# Altium project RGB_Controller_AC.PrjPcb
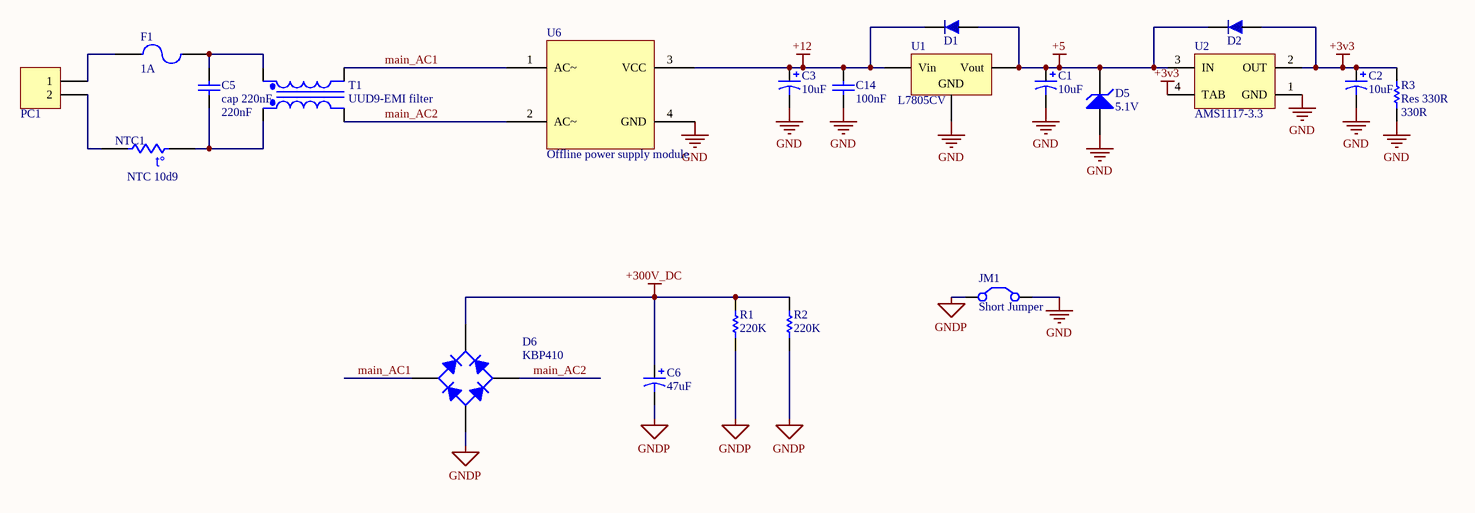
[diagram p0: power.SchDoc]
3 sheets, 70 parts. Net scope: flat (ports and power ports of the same name join across sheets).
Board files: RGB_driver_AC_2.PcbDoc, RGB_driver_AC.PcbDoc
Sheets:
  power.SchDoc
  micro.SchDoc
  driver.SchDoc

## Sheet power.SchDoc
size A4; SheetNumber: 1; SheetTotal: 3; SPICEModelCacheXGUZSKWJ: <root> / <DocumentId>XGUZSKWJ</DocumentId> / <CacheFrame Number="0"> / <Model Name="cap" Kind="MDL"> / <Text>*Default semiconductor capacitor / .MODEL CAP C()</Text> / </Model> / <Model Name="zener" Kind="MDL"> / <Text>*ZENER / *Default Zener 10V @ 10mA / *Zener Diode Pinout: A,K / .MODEL ZENER D( BV=10 IBV=10E-3 )</Text> / </Model> / <Model Name="fuse" Kind="CKT"> / <Text>.SUBCKT FUSE 1 2 PARAMS: CURRENT=1 RESISTANCE=1m / SW1 1 2 3 0 SMOD OFF / BNLV 3 0 V=(abs(v(1,2))) / .MODEL SMOD SW (VT={(CURRENT*RESISTANCE)} RON=1g ROFF={RESISTANCE}) / .ENDS FUSE</Text> / </Model> / </CacheFrame> / </root>

### Parts
C1  value 10uF  [CAP0805]  (hidden comment: cap 10uF)
C2  value 10uF  [CAP0805]  (hidden comment: cap 10uF)
C3  value 10uF  [CAP0805]  (hidden comment: cap 10uF)
C5  cap 220nF  value 220nF  [MKT-15mm]
C6  value 47uF  [Cap16MM]  (hidden comment: cap 47uF)
C14  value 100nF  [CAP0805]  (hidden comment: cap 100nF)
D1  uf4007  [DIOM4629X24N]  (value not drawn)
D2  uf4007  [DIOM4629X24N]  (value not drawn)
D5  5.1V  [Diode 1n4148 SMD]
D6  KBP410  [Bridge KBL PACKAGE]
F1  1A  [PIN-W2/E2.8]
JM1  Short Jumper  [short_bridge]  (net tie, no BOM)
NTC1  NTC 10d9  [CAPNTO5.08-7.37x3.94]
PC1  Power Connector  [phoenix terminal R 2]  (value not drawn)
R1  value 220K  [RES-(1/2)-Stand]  (hidden comment: Res 220K)
R2  value 220K  [RES-(1/2)-Stand]  (hidden comment: Res 220K)
R3  Res 330R  value 330R  [RES0805]
T1  UUD9-EMI filter  [UUD9.8]
U1  L7805CV  [REG-7805-smd]
U2  AMS1117-3.3  [SOT223]
U6  Offline power supply module  [220AC-12VDC  450mA]

### Nets
+3v3: C2.1 D2.1 R3.2 U2.2(OUT) U2.4(TAB)
+5: C1.1 D1.1 D2.2 D5.2(K) U1.3(Vout) U2.3(IN)
+12: C3.1 C14.1 D1.2 U1.1(Vin) U6.3(VCC)
+300V_DC: C6.1 D6.1(K) R1.2 R2.2
GND: C1.2 C2.2 C3.2 C14.2 D5.1(A) JM1.2 R3.1 U1.2(GND) U2.1(GND) U6.4(GND)
GNDP: C6.2 D6.3(A) JM1.1 R1.1 R2.1
main_AC1: D6.4(C) T1.4(Sec-) U6.1(AC~)
main_AC2: D6.2(C) T1.2(Pri-) U6.2(AC~)
NetC5_1: C5.1 NTC1.1 T1.1(Pri+)
NetC5_2: C5.2 F1.2 T1.3(Sec+)
NetF1_1: F1.1 PC1.1
NetNTC1_2: NTC1.2 PC1.2

### Notes on the sheet
- (in symbol Res Thermal) t°

### Library data of the parts
C1-C3 = Cap Pol1: CAP seramic; Published: 8-Jun-2000; LatestRevisionDate: 17-Jul-2002; LatestRevisionNote: Re-released for DXP Platform.; PackageReference: RB7.6-15; Publisher: Altium Limited; PackageDescription: Polarized Capacitor (Radial); 2 Leads
C5 = Cap: Cap MKT 275V; Published: 8-Jun-2000; LatestRevisionDate: 17-Jul-2002; LatestRevisionNote: Re-released for DXP Platform.; PackageReference: RAD-0.3; Publisher: Altium Limited; PackageDescription: Radial Cap, Thru-Hole; 2 Leads; 0.3 in Pin Spacing
C6 = Cap Pol1: Polarized Capacitor (Radial) 400V; Published: 8-Jun-2000; LatestRevisionDate: 17-Jul-2002; LatestRevisionNote: Re-released for DXP Platform.; PackageReference: RB7.6-15; Publisher: Altium Limited; PackageDescription: Polarized Capacitor (Radial); 2 Leads
C14 = Cap ceramic: CAP seramic
D1 D2 = 1n4007 SMD M7: Standard Rectifiers; Part. No: M7; Manufacturer: DC COMPONENTS; Designer: Abbas Basereh; Link: http://www.tme.eu/en/details/m7/smd-universal-diodes/dc-components/; Link: https://www.aliexpress.com/item/Smd-tube-1n4007-m7-SMA/1213719741.html?spm=2114.01010208.3.1.ZyZ7bC&ws_ab_test=searchweb0_0,searchweb201602_4_10065_10068_10084_10083_10080_10082_10081_10060_10061_10062_10056_10055_10054_10059_10099_10078_10079_427_10073_10103_10102_10096_10052_10050_10051,searchweb201603_4&btsid=db2be5ca-e560-400a-b91c-484ab5ee228b; Data: 16-12-2016
D5 = D Zener: Zener Diode; Published: 8-Jun-2000; LatestRevisionDate: 17-Jul-2002; LatestRevisionNote: Re-released for DXP Platform.; PackageReference: DIODE-0.7; Publisher: Altium Limited; PackageDescription: Diode, Thru-Hole; 2 Leads; 0.7 in Pin Spacing
D6 = Diode Bridge: pin to pad: 3>4 4>3; Company: E.P.I.L; Design Date: 2011/11/02
F1 = Fuse 2: Fuse; Published: 8-Jun-2000; LatestRevisionDate: 17-Jul-2002; LatestRevisionNote: Re-released for DXP Platform.; PackageReference: PIN-W2/E2.8; Publisher: Altium Limited; PackageDescription: Thru-Hole; 2 Leads
JM1 = Solder Jumper: short circuit
NTC1 = Res Thermal: NTC; Published: 24-Mar-1999; LatestRevisionDate: 29-May-2009; LatestRevisionNote: IPC-7351 Footprint Added.; PackageVersion: Mar-2003; PackageReference: 6-0805; Publisher: Altium Limited; PackageDescription: Chip Resistor 0805 Case Size; Code_IPC: RESC2012
PC1 = Power Connector: white Power Connector
R1-R3 = Res1: Resistor; Published: 8-Jun-2000; LatestRevisionDate: 17-Jul-2002; LatestRevisionNote: Re-released for DXP Platform.; PackageReference: AXIAL-0.3; Publisher: Altium Limited; PackageDescription: Axial Device, Thru-Hole; 2 Leads; 0.3 in Pin Spacing
T1 = Trans Cupl: Line filter; Published: 8-Jun-2000; LatestRevisionDate: 17-Jul-2002; LatestRevisionNote: Re-released for DXP Platform.; PackageReference: TRF_4; Publisher: Altium Limited; PackageDescription: Transformer; 4 Leads
U1 = L7805CV-Linear Voltage Regulator IC Positive 1 Output 5V 1.5A TO-220AB: Linear Voltage Regulator IC Positive FIXED; Manufacturer: STMicroelectronics; Designer: Abbas Basereh; Link: https://www.aliexpress.com/item/; Link: http://www.tme.eu/en/; Link: http://www.digikey.com/; Part. No: L7805CV
U2 = AMS1117-x.x: x.x Volt, 800mA Low-Dropout Linear Regulator, 4-pin SOT-223; Designer: Ali Hafizi; Data: 16-12-2016
U6 = Power Supply Module

## Sheet micro.SchDoc
size A4; SheetNumber: 2; SheetTotal: 3; SPICEModelCacheMVBHQZXF: <root> / <DocumentId>MVBHQZXF</DocumentId> / <CacheFrame Number="0"> / <Model Name="2n3904" Kind="MDL"> / <Text>*2N3904 / *Si 310mW  40V 200mA 300MHz pkg:TO-92B 1,2,3 / .MODEL 2N3904 NPN(IS=1.4E-14 BF=300 VAF=100 IKF=0.025 ISE=3E-13 / + BR=7.5 RC=2.4 CJE=4.5E-12 TF=4E-10 CJC=3.5E-12 TR=2.1E-8 XTB=1.5 KF=9E-16 )</Text> / </Model> / <Model Name="led0" Kind="MDL"> / <Text>*Typ INFRARED GaAs LED: Vf=1.2V Vr=5V If=40mA trr=3uS / *LED Pinout: 1=A, 2=K / .MODEL LED0 D (IS=93.5P RS=84M N=2.63 BV=5 IBV=10U / + CJO=2.97P VJ=.75 M=.333 TT=4.32U)</Text> / </Model> / </CacheFrame> / </root>
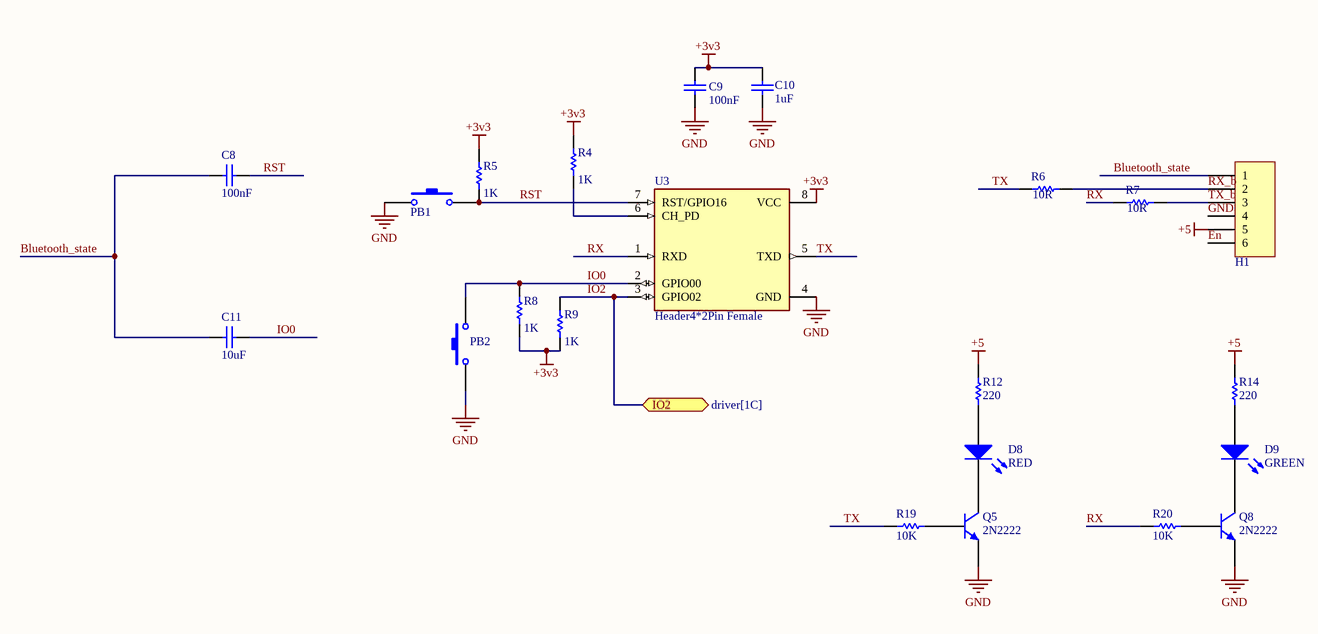
[diagram p1: micro.SchDoc]

### Parts
C8  value 100nF  [CAP0805]  (hidden comment: cap 100nF)
C9  value 100nF  [CAP0805]  (hidden comment: cap 100nF)
C10  value 1uF  [CAP0805]  (hidden comment: cap 1uF)
C11  value 10uF  [CAP0805]  (hidden comment: cap 10uF)
D8  RED  [LED_0603 R]
D9  GREEN  [LED_0603 G]
H1  H-1x6  [H-1x6]  (value not drawn)
PB1  Push-Button-tall  [tack-sw-3x5x6]  (value not drawn)
PB2  Push-Button-tall  [tack-sw-3x5x6]  (value not drawn)
Q5  2N2222  [SOT23_BEC_L]
Q8  2N2222  [SOT23_BEC_L]
R4  value 1K  [RES0805]  (hidden comment: Res 1K)
R5  value 1K  [RES0805]  (hidden comment: Res 1K)
R6  value 10R  [RES0805]  (hidden comment: Res 10R)
R7  value 10R  [RES0805]  (hidden comment: Res 10R)
R8  value 1K  [RES0805]  (hidden comment: Res 1K)
R9  value 1K  [RES0805]  (hidden comment: Res 1K)
R12  value 220  [RES0805]  (hidden comment: Res 220)
R14  value 220  [RES0805]  (hidden comment: Res 220)
R19  value 10K  [RES0805]  (hidden comment: Res 10K)
R20  value 10K  [RES0805]  (hidden comment: Res 10K)
U3  Header4*2Pin Female  [ESP8266-01/ESP-01]

### Ports
IO2 (bidir, see driver[1C])

### Nets
+3v3: C9.2 C10.1 R4.1 R5.1 R8.2 R9.2 U3.8(VCC)
+5: H1.5 R12.2 R14.2
GND: C9.1 C10.2 H1.4 PB1.1 PB2.1 Q5.1(E) Q8.1(E) U3.4(GND)
Bluetooth_state: C8.2 C11.2 H1.1
En: H1.6
IO0: C11.1 PB2.2 R8.1 U3.2(GPIO00)
IO2: R9.1 U3.3(GPIO02) ; port IO2
RST: C8.1 PB1.2 R5.2 U3.7(RST/GPIO16)
RX: R7.2 R20.1 U3.1(RXD)
RX_b: H1.2 R6.2
TX: R6.1 R19.1 U3.5(TXD)
TX_b: H1.3 R7.1
NetD8_1: D8.1(A) R12.1
NetD8_2: D8.2(K) Q5.3(C)
NetD9_1: D9.1(A) R14.1
NetD9_2: D9.2(K) Q8.3(C)
NetQ5_2: Q5.2(B) R19.2
NetQ8_2: Q8.2(B) R20.2
NetR4_2: R4.2 U3.6(CH_PD)

### Library data of the parts
C8-C11 = Cap ceramic: CAP seramic
D8 D9 = LED0: Typical INFRARED GaAs LED; Published: 8-Jun-2000; LatestRevisionDate: 08-Jul-2005; LatestRevisionNote: Mech Layer 1 removed.; PackageReference: LED-0; Publisher: Altium Limited; PackageDescription: LED; 2 Leads
H1 = H-1x6: Bluetooth module HC05
Q5 Q8 = 2N3904: NPN General Purpose Amplifier; pin to pad: 1>2 2>1; Published: 8-Jun-2000; LatestRevisionDate: 15-Jan-2003; LatestRevisionNote: PCB Footprint 'BCY-W3/D4.7' replaced; DatasheetVersion: 1997; PackageVersion: Sep-1998; PackageReference: TO-92A; Publisher: Altium Limited; PackageDescription: TO, Flat Index; 3 In-Line, Axial Leads; Body Dia. 4.5mm; Leads 0.51 x 0.48 mm (max); ComponentLink1Description: Manufacturer Link; ComponentLink1URL: http://www.fairchildsemi.com/; ComponentLink2Description: Datasheet; ComponentLink2URL: http://www.fairchildsemi.com/ds/2N%2F2N3904.pdf
R4-R9 R12 R14 R19 R20 = Res1: Resistor; Published: 8-Jun-2000; LatestRevisionDate: 17-Jul-2002; LatestRevisionNote: Re-released for DXP Platform.; PackageReference: AXIAL-0.3; Publisher: Altium Limited; PackageDescription: Axial Device, Thru-Hole; 2 Leads; 0.3 in Pin Spacing
U3 = ESP8266-01/ESP-01: ESP-01 wifi module; MF: AI-Thinker; Package: None; Availability: Unavailable; MP: ESP8266-01/ESP-01; Value: *; SnapEDA_Link: https://www.snapeda.com/parts/ESP8266-01/ESP-01/AI-Thinker/view-part/106413/?ref=snap; Price: None

## Sheet driver.SchDoc
size A4; SheetNumber: 3; SheetTotal: 3; SPICEModelCacheZVOPVZIA: <root> / <DocumentId>ZVOPVZIA</DocumentId> / <CacheFrame Number="0"> / <Model Name="nmos" Kind="MDL"> / <Text>*Default N-Channel MOSFET / *Pinout: D,G,S / .MODEL NMOS NMOS()</Text> / </Model> / <Model Name="2n3904" Kind="MDL"> / <Text>*2N3904 / *Si 310mW  40V 200mA 300MHz pkg:TO-92B 1,2,3 / .MODEL 2N3904 NPN(IS=1.4E-14 BF=300 VAF=100 IKF=0.025 ISE=3E-13 / + BR=7.5 RC=2.4 CJE=4.5E-12 TF=4E-10 CJC=3.5E-12 TR=2.1E-8 XTB=1.5 KF=9E-16 )</Text> / </Model> / <Model Name="cap" Kind="MDL"> / <Text>*Default semiconductor capacitor / .MODEL CAP C()</Text> / </Model> / </CacheFrame> / </root>
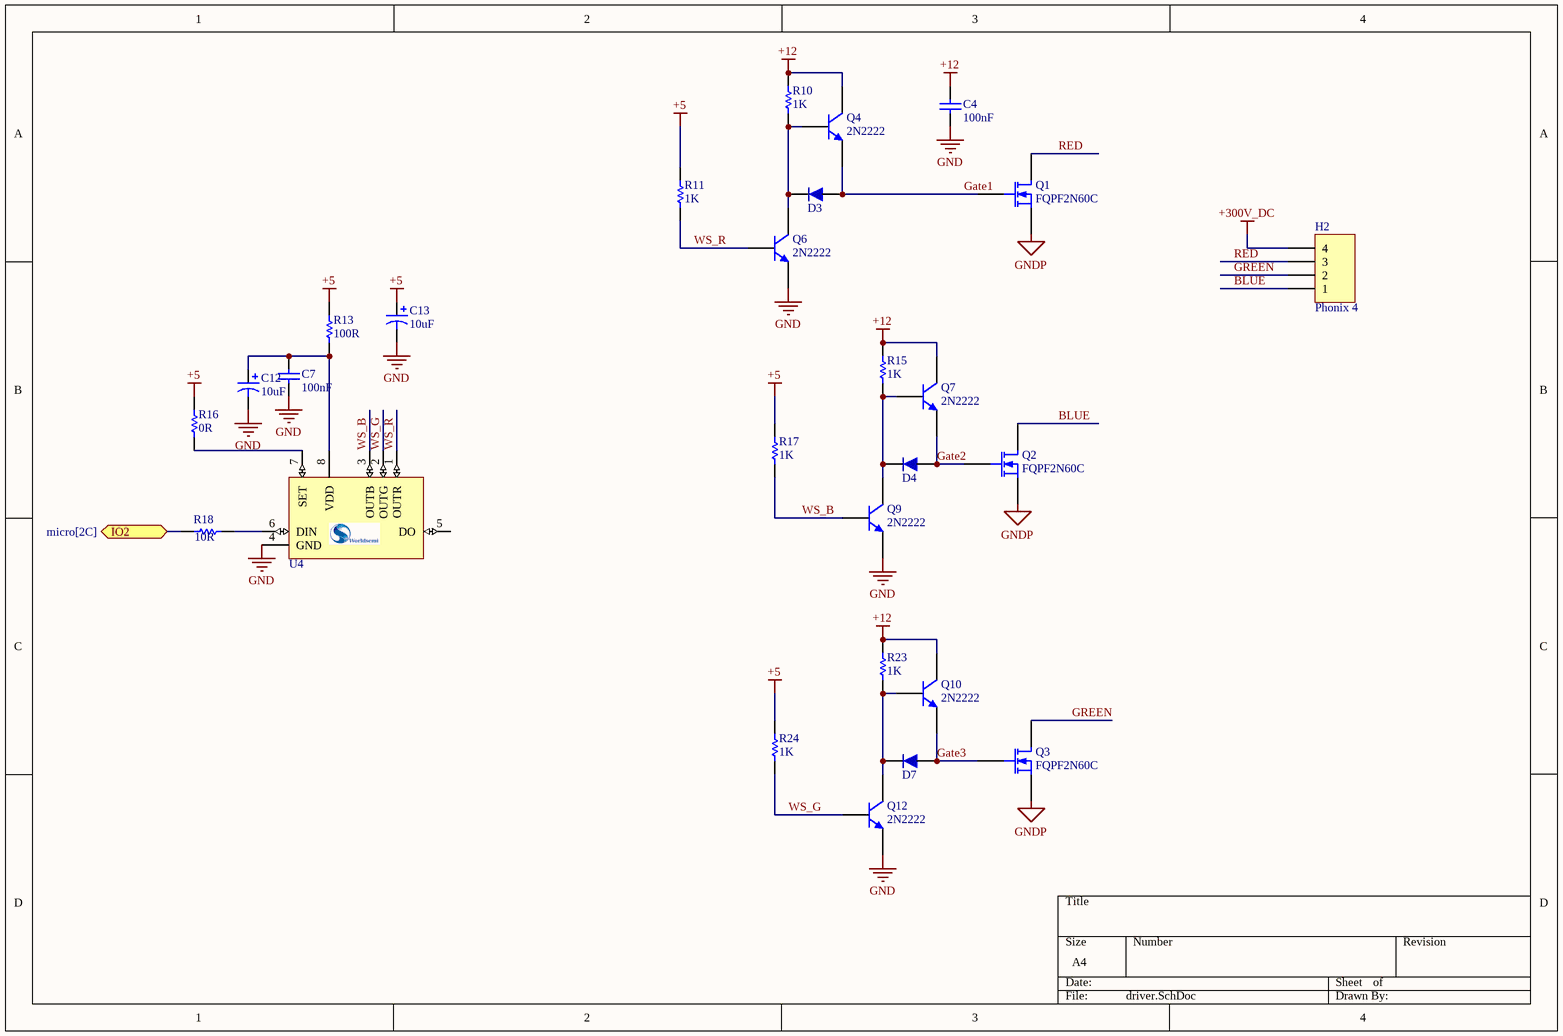
[diagram p2: driver.SchDoc]

### Parts
C4  value 100nF  [CAP0805]  (hidden comment: cap 100nF)
C7  value 100nF  [CAP0805]  (hidden comment: cap 100nF)
C12  value 10uF  [CAP0805]  (hidden comment: cap 10uF)
C13  value 10uF  [CAP0805]  (hidden comment: cap 10uF)
D3  1n5822  [DIOM4629X24N]  (value not drawn)
D4  1n5822  [DIOM4629X24N]  (value not drawn)
D7  1n5822  [DIOM4629X24N]  (value not drawn)
H2  Phonix 4  [phoenix terminal R 4]
Q1  FQPF2N60C  [TO-220]
Q2  FQPF2N60C  [TO-220]
Q3  FQPF2N60C  [TO-220]
Q4  2N2222  [SOT23_BEC_L]
Q6  2N2222  [SOT23_BEC_L]
Q7  2N2222  [SOT23_BEC_L]
Q9  2N2222  [SOT23_BEC_L]
Q10  2N2222  [SOT23_BEC_L]
Q12  2N2222  [SOT23_BEC_L]
R10  value 1K  [RES0805]  (hidden comment: Res 1K)
R11  value 1K  [RES0805]  (hidden comment: Res 1K)
R13  value 100R  [RES0805]  (hidden comment: Res 100R)
R15  value 1K  [RES0805]  (hidden comment: Res 1K)
R16  value 0R  [RES0805]  (hidden comment: Res 0R)
R17  value 1K  [RES0805]  (hidden comment: Res 1K)
R18  value 10R  [RES0805]  (hidden comment: Res 10R)
R23  value 1K  [RES0805]  (hidden comment: Res 1K)
R24  value 1K  [RES0805]  (hidden comment: Res 1K)
U4  WS2811 SMD  [8S2_N]  (value not drawn)

### Ports
IO2 (bidir, see micro[2C])

### Nets
+5: C13.1 R11.1 R13.2 R16.2 R17.1 R24.1
+12: C4.1 Q4.3(C) Q7.3(C) Q10.3(C) R10.2 R15.2 R23.2
+300V_DC: H2.4
GND: C4.2 C7.2 C12.2 C13.2 Q6.1(E) Q9.1(E) Q12.1(E) U4.4(GND)
GNDP: Q1.3(S) Q2.3(S) Q3.3(S)
BLUE: H2.1 Q2.1(D)
Gate1: D3.1 Q1.2(G) Q4.1(E)
Gate2: D4.1 Q2.2(G) Q7.1(E)
Gate3: D7.1 Q3.2(G) Q10.1(E)
GREEN: H2.2 Q3.1(D)
IO2: R18.1 ; port IO2
RED: H2.3 Q1.1(D)
WS_B: Q9.2(B) R17.2 U4.3(OUTB)
WS_G: Q12.2(B) R24.2 U4.2(OUTG)
WS_R: Q6.2(B) R11.2 U4.1(OUTR)
NetC7_1: C7.1 C12.1 R13.1 U4.8(VDD)
NetD3_2: D3.2 Q4.2(B) Q6.3(C) R10.1
NetD4_2: D4.2 Q7.2(B) Q9.3(C) R15.1
NetD7_2: D7.2 Q10.2(B) Q12.3(C) R23.1
NetR16_1: R16.1 U4.7(SET)
NetR18_2: R18.2 U4.6(DIN)

Not connected (* = marked no-connect by the designer): U4 5(DO)

### Library data of the parts
C4 C7 = Cap ceramic: CAP seramic
C12 C13 = Cap Pol1: CAP seramic; Published: 8-Jun-2000; LatestRevisionDate: 17-Jul-2002; LatestRevisionNote: Re-released for DXP Platform.; PackageReference: RB7.6-15; Publisher: Altium Limited; PackageDescription: Polarized Capacitor (Radial); 2 Leads
D3 D4 D7 = 1n4007 SMD M7: Schotcky diode; Part. No: M7; Manufacturer: DC COMPONENTS; Designer: Abbas Basereh; Link: http://www.tme.eu/en/details/m7/smd-universal-diodes/dc-components/; Link: https://www.aliexpress.com/item/Smd-tube-1n4007-m7-SMA/1213719741.html?spm=2114.01010208.3.1.ZyZ7bC&ws_ab_test=searchweb0_0,searchweb201602_4_10065_10068_10084_10083_10080_10082_10081_10060_10061_10062_10056_10055_10054_10059_10099_10078_10079_427_10073_10103_10102_10096_10052_10050_10051,searchweb201603_4&btsid=db2be5ca-e560-400a-b91c-484ab5ee228b; Data: 16-12-2016
H2 = Header 4: Header, 4-Pin; LatestRevisionDate: 17-Jul-2002; LatestRevisionNote: Re-released for DXP Platform.; Publisher: Altium Limited
Q1-Q3 = MOSFET-N: N-Channel MOSFET; pin to pad: 1>2 2>1; Published: 8-Jun-2000; LatestRevisionDate: 17-Jul-2002; LatestRevisionNote: Re-released for DXP Platform.; PackageVersion: 1995/1996; PackageReference: E3; Publisher: Altium Limited; PackageDescription: TO, Flat Index; 3 In-Line, Axial Leads; Body Dia. 4.6mm; Lead Dia. 0.5 mm (max)
Q4 Q6 Q7 Q9 Q10 Q12 = 2N3904: NPN General Purpose Amplifier; pin to pad: 1>2 2>1; Published: 8-Jun-2000; LatestRevisionDate: 15-Jan-2003; LatestRevisionNote: PCB Footprint 'BCY-W3/D4.7' replaced; DatasheetVersion: 1997; PackageVersion: Sep-1998; PackageReference: TO-92A; Publisher: Altium Limited; PackageDescription: TO, Flat Index; 3 In-Line, Axial Leads; Body Dia. 4.5mm; Leads 0.51 x 0.48 mm (max); ComponentLink1Description: Manufacturer Link; ComponentLink1URL: http://www.fairchildsemi.com/; ComponentLink2Description: Datasheet; ComponentLink2URL: http://www.fairchildsemi.com/ds/2N%2F2N3904.pdf
R10 R11 R13 R15-R18 R23 R24 = Res1: Resistor; Published: 8-Jun-2000; LatestRevisionDate: 17-Jul-2002; LatestRevisionNote: Re-released for DXP Platform.; PackageReference: AXIAL-0.3; Publisher: Altium Limited; PackageDescription: Axial Device, Thru-Hole; 2 Leads; 0.3 in Pin Spacing
U4 = WS2811 SMD: LED Driver IC 3 Output Linear 18.5mA Module 10PK; ComponentAvailability: Not recommended for new design.; Published: 2017-1-30; DatasheetVersion: 30-1-2017; PackageVersion: 30-1-2017; PackageReference: 8S2; Publisher: Abbas Basereh; PackageDescription: SOP-8; Supplier 1: Digi-Key; Supplier Part Number 1: WS2811; Supplier 2: Farnell; Supplier Part Number 2: 1378; Supplier 3: Mouser; Supplier Part Number 3: 1528-1537-ND; ComponentLink1Description: LED Driver IC 3 Output Linear 18.5mA Module 10PK; ComponentLink1URL: http://www.world-semi.com; ComponentLink2Description: WS2811; ComponentLink3Description: WS2811; ComponentLink4Description: http://www.world-semi.com

## Nets that join several sheets
+3v3: power (5 pins), micro (7 pins)
+5: power (6 pins), micro (H1.5 R12.2 R14.2), driver (6 pins)
+12: power (5 pins), driver (7 pins)
+300V_DC: power (C6.1 D6.1 R1.2 R2.2), driver (H2.4)
GND: power (10 pins), micro (8 pins), driver (8 pins)
GNDP: power (5 pins), driver (Q1.3 Q2.3 Q3.3)
IO2: micro (R9.1 U3.3), driver (R18.1)